# Altium schematic sheet MCU.SchDoc
size A4
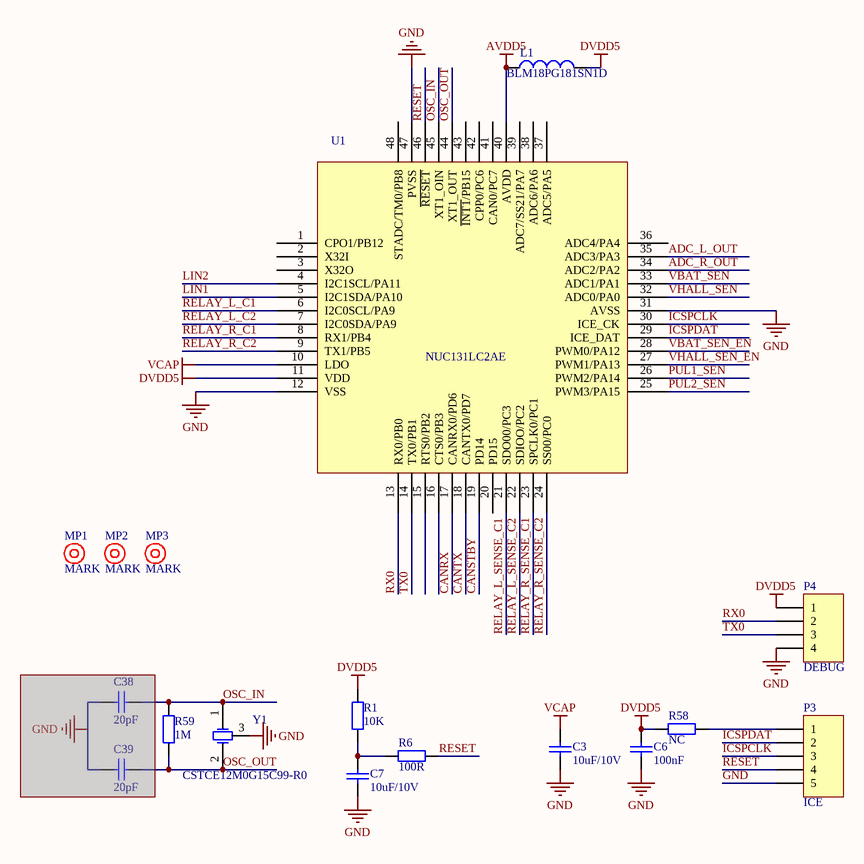
[diagram p0: MCU.SchDoc]

## Parts
C3  10uF/10V  [LC-0603_C]
C6  100nF  [LC-0603_C]
C7  10uF/10V  [LC-0603_C]
C38  20pF  [LC-0603_C]
C39  20pF  [LC-0603_C]
L1  BLM18PG181SN1D  [LC-0603_L]
MP1  MARK  [MARK]
MP2  MARK  [MARK]
MP3  MARK  [MARK]
P3  ICE  [HDR1X5]
P4  DEBUG  [HDR1X4]
R1  10K  [LC-0603_R]
R6  100R  [LC-0603_R]
R58  NC  [LC-0603_R]
R59  1M  [LC-0603_R]
U1  NUC131LC2AE  [LC-LQFP-48_7x7x05P]
Y1  CSTCE12M0G15C99-R0  [SMD_8M_3]

## Nets
AVDD5: L1.1 U1.40(AVDD)
DVDD5: C6.1 L1.2 P4.1 R1.2 R58.1 U1.11(VDD)
GND: C3.2 C6.2 C7.2 P3.5 P4.4 U1.12(VSS) U1.31(AVSS) U1.47(PVSS) Y1.3(OSC3)
VCAP: C3.1 U1.10(LDO)
ADC_L_OUT: U1.35(ADC3/PA3)
ADC_R_OUT: U1.34(ADC2/PA2)
CANRX: U1.17(CANRX0/PD6)
CANSTBY: U1.19(PD14)
CANTX: U1.18(CANTX0/PD7)
ICSPCLK: P3.3 U1.30(ICE_CK)
ICSPDAT: P3.2 U1.29(ICE_DAT)
LIN1: U1.5(I2C1SDA/PA10)
LIN2: U1.4(I2C1SCL/PA11)
OSC_IN: C38.1 R59.2 U1.45(XT1_OIN) Y1.1(OSC1)
OSC_OUT: C39.1 R59.1 U1.44(XT1_OUT) Y1.2(OSC2)
PUL1_SEN: U1.26(PWM2/PA14)
PUL2_SEN: U1.25(PWM3/PA15)
RELAY_L_C1: U1.6(I2C0SCL/PA9)
RELAY_L_C2: U1.7(I2C0SDA/PA9)
RELAY_L_SENSE_C1: U1.21(SDO00/PC3)
RELAY_L_SENSE_C2: U1.22(SDIOO/PC2)
RELAY_R_C1: U1.8(RX1/PB4)
RELAY_R_C2: U1.9(TX1/PB5)
RELAY_R_SENSE_C1: U1.23(SPCLK0/PC1)
RELAY_R_SENSE_C2: U1.24(SS00/PC0)
RESET: P3.4 R6.1 U1.46(~{RESET})
RX0: P4.2 U1.13(RX0/PB0)
TX0: P4.3 U1.14(TX0/PB1)
VBAT_SEN: U1.33(ADC1/PA1)
VBAT_SEN_EN: U1.28(PWM0/PA12)
VHALL_SEN: U1.32(ADC0/PA0)
VHALL_SEN_EN: U1.27(PWM1/PA13)
NetC7_1: C7.1 R1.1 R6.2
NetP3_1: P3.1 R58.2

Not connected (* = marked no-connect by the designer): C38 2; C39 2; U1 1(CPO1/PB12) 2(X32I) 3(X32O) 15(RTS0/PB2) 16(CTS0/PB3) 20(PD15) 36(ADC4/PA4) 37(ADC5/PA5) 38(ADC6/PA6) 39(ADC7/SS21/PA7) 41(CAN0/PC7) 42(CPP0/PC6) 43(~{INT1}/PB15) 48(STADC/TM0/PB8)

## Library data of the parts
C3 C6 C7 C38 C39 = 0805 6pF (6R0) 0.25pF 50V: 贴片电容; ComponentLink1Description: 供应商链接; ComponentLink1URL: http://www.szlcsc.com/product/details_68656.html; Package: 0805; Supplier: LC; SuppliersPartNumber: C67560
L1 = Inductor: Code_IEC: 1005; Value: 10mH; Published: 8-Jun-2000; LatestRevisionDate: 29-May-2009; LatestRevisionNote: IPC-7351 Footprint Added.; PackageReference: 0402-A; Publisher: Altium Limited; PackageDescription: Chip Inductor; Code_JEITA: 0402
P3 = Header 5: Header, 5-Pin; LatestRevisionDate: 17-Jul-2002; LatestRevisionNote: Re-released for DXP Platform.; Publisher: Altium Limited
P4 = Header 4: Header, 4-Pin; LatestRevisionDate: 17-Jul-2002; LatestRevisionNote: Re-released for DXP Platform.; Publisher: Altium Limited
R1 R6 R58 R59 = 0805 15KΩ (1502) 1%: 贴片电阻; ComponentLink1Description: 供应商链接; ComponentLink1URL: http://www.szlcsc.com/product/details_18163.html; Package: 0805; Supplier: LC; SuppliersPartNumber: C17475
Y1 = CSTC